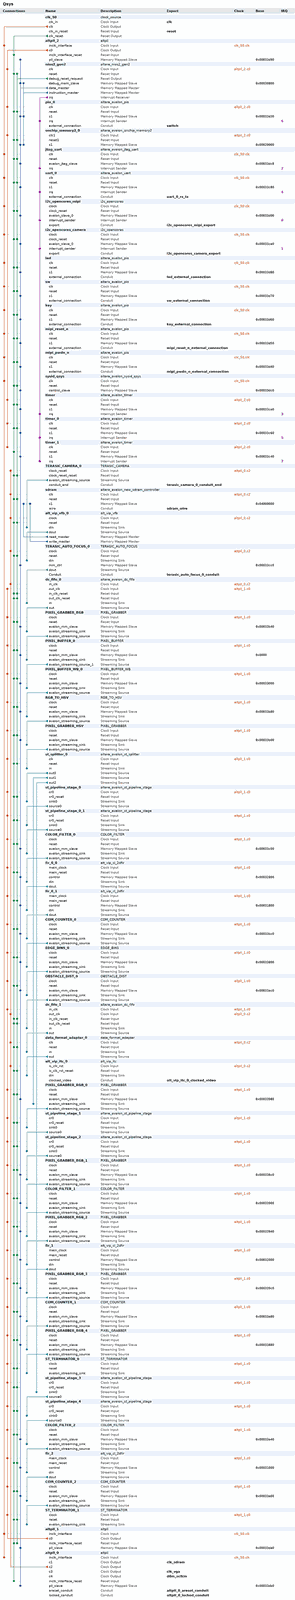
[diagram p0: system contents, whole]
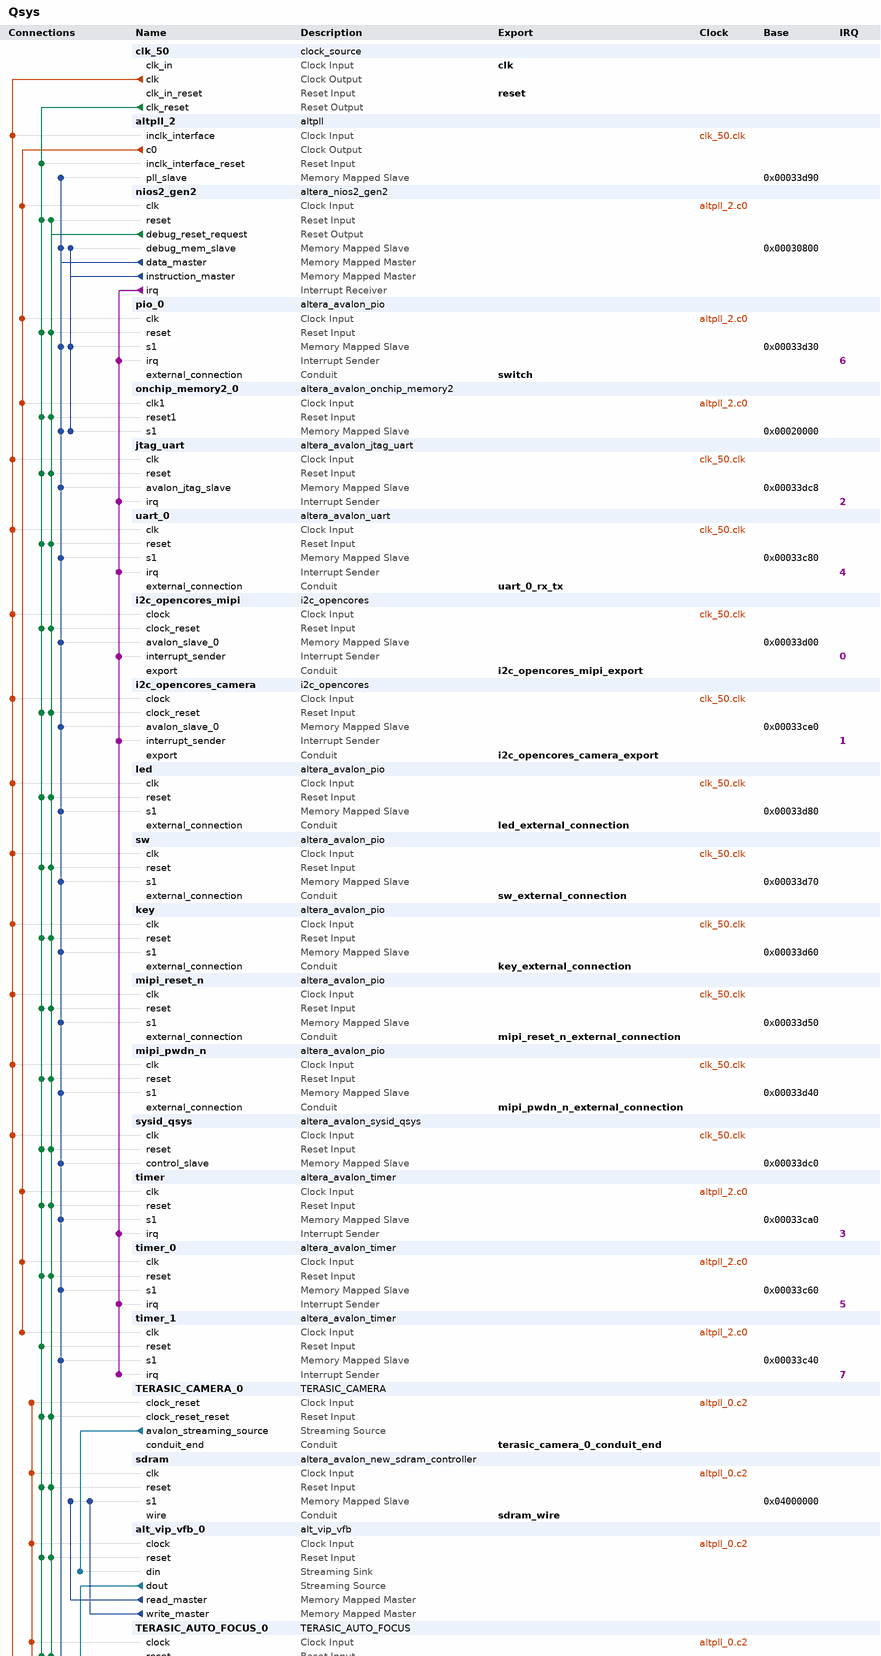
[diagram p1: system contents, upper part]
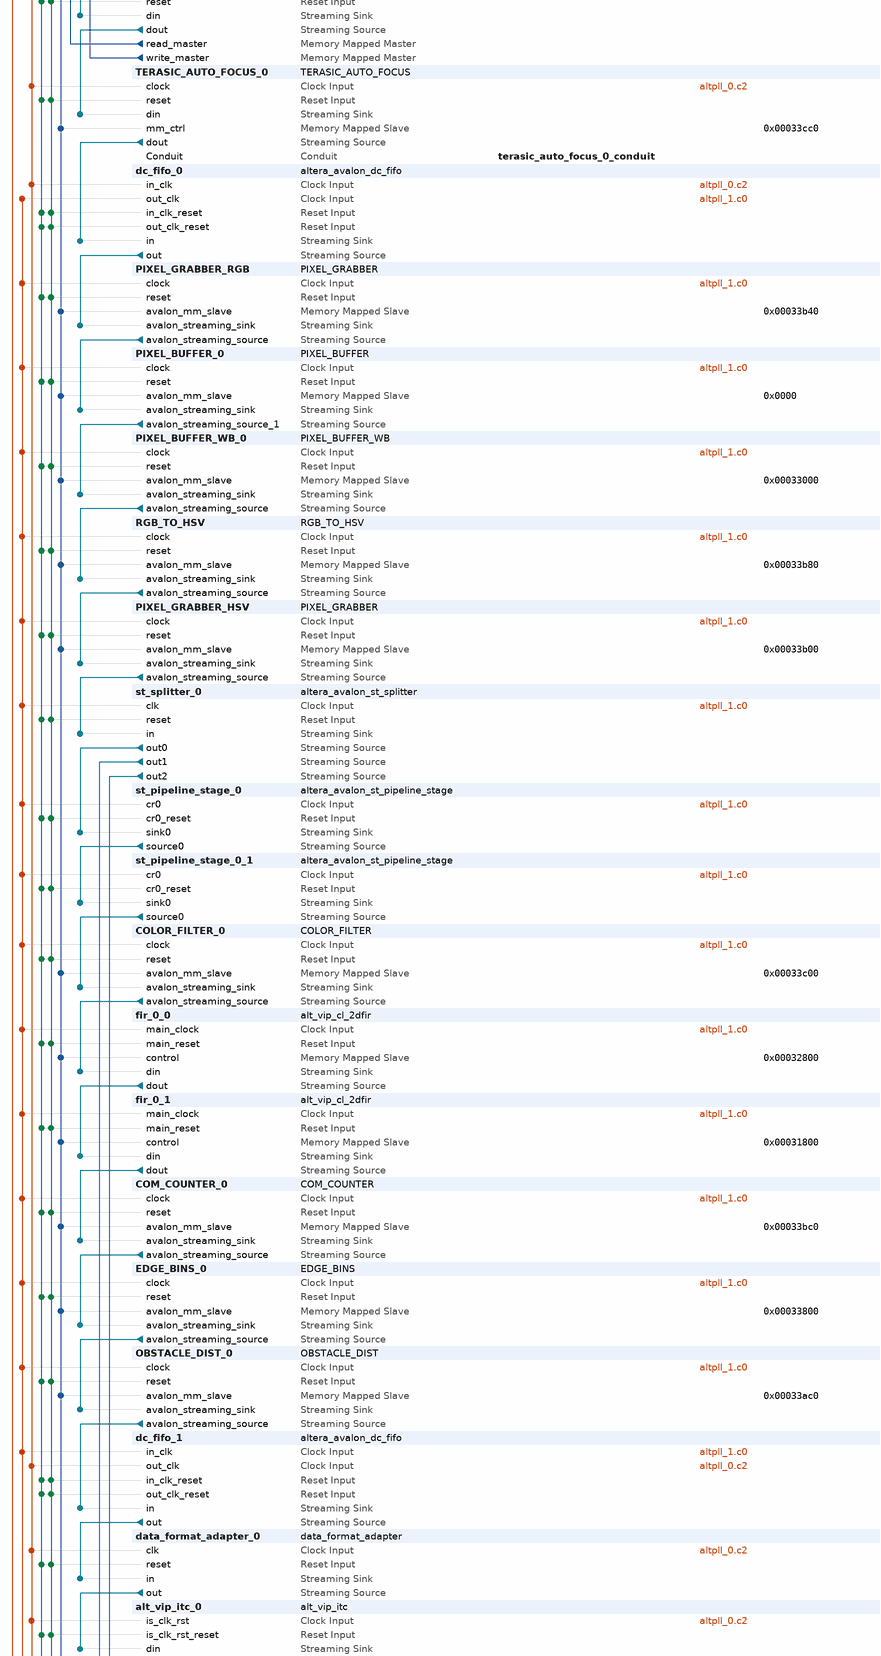
[diagram p2: system contents, middle part]
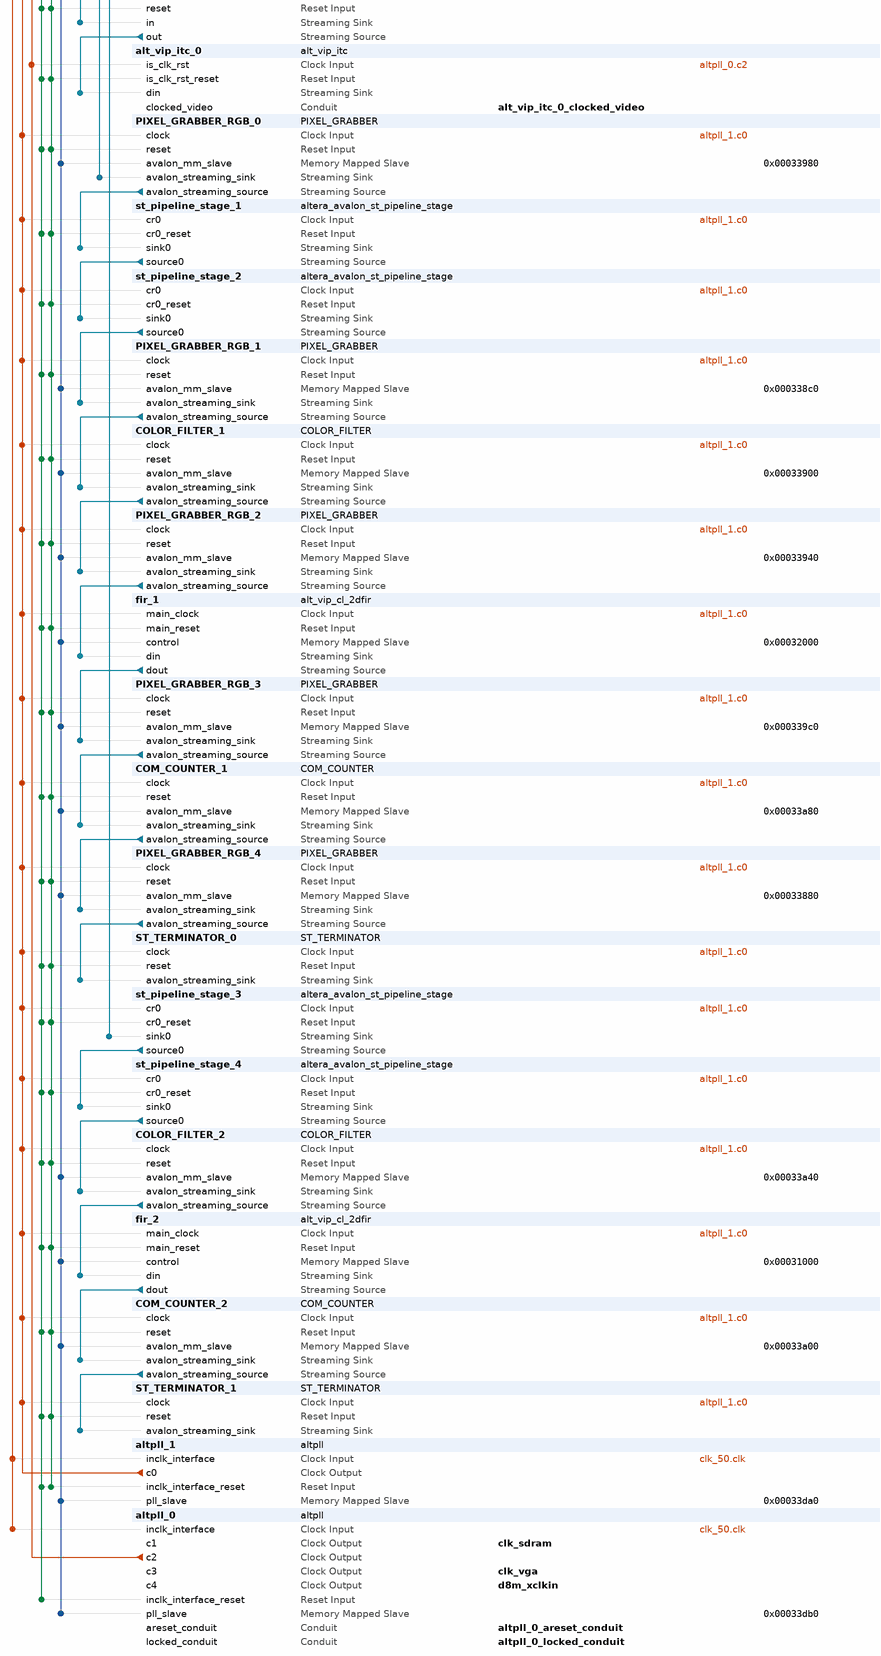
[diagram p3: system contents, lower part]
# Platform Designer (Qsys) system Qsys, MAX 10 10M50DAF484C7G
# Parameters at their usual value, and those the tool derives, are not listed.
package require -exact qsys 18.1
create_system Qsys
set_project_property DEVICE_FAMILY {MAX 10}
set_project_property DEVICE 10M50DAF484C7G

add_instance clk_50 clock_source 18.1
set_instance_parameter_value clk_50 clockFrequency 50000000

add_instance altpll_2 altpll 18.1
set_instance_parameter_value altpll_2 CLK0_DIVIDE_BY 5
set_instance_parameter_value altpll_2 CLK0_MULTIPLY_BY 7
set_instance_parameter_value altpll_2 INCLK0_INPUT_FREQUENCY 20000
set_instance_parameter_value altpll_2 PORT_ARESET PORT_UNUSED
set_instance_parameter_value altpll_2 PORT_LOCKED PORT_UNUSED
set_instance_parameter_value altpll_2 PORT_clk1 PORT_UNUSED
set_instance_parameter_value altpll_2 PORT_clk2 PORT_UNUSED
set_instance_parameter_value altpll_2 PORT_clk3 PORT_UNUSED

add_instance nios2_gen2 altera_nios2_gen2 18.1
set_instance_parameter_value nios2_gen2 dcache_size 4096
set_instance_parameter_value nios2_gen2 exceptionSlave onchip_memory2_0.s1
set_instance_parameter_value nios2_gen2 icache_size 4096
set_instance_parameter_value nios2_gen2 impl Fast
set_instance_parameter_value nios2_gen2 resetSlave onchip_memory2_0.s1

add_instance pio_0 altera_avalon_pio 18.1
set_instance_parameter_value pio_0 captureEdge true
set_instance_parameter_value pio_0 direction Input
set_instance_parameter_value pio_0 generateIRQ true
set_instance_parameter_value pio_0 irqType EDGE
set_instance_parameter_value pio_0 width 1

add_instance onchip_memory2_0 altera_avalon_onchip_memory2 18.1
set_instance_parameter_value onchip_memory2_0 dataWidth 32
set_instance_parameter_value onchip_memory2_0 dualPort false
set_instance_parameter_value onchip_memory2_0 initMemContent true
set_instance_parameter_value onchip_memory2_0 initializationFileName /home/mp3120/nfshome/DE10_CAM_VISION/software/cam_vision2/mem_init/Qsys_onchip_memory2_0.hex
set_instance_parameter_value onchip_memory2_0 memorySize 60000
set_instance_parameter_value onchip_memory2_0 useNonDefaultInitFile true

add_instance jtag_uart altera_avalon_jtag_uart 18.1
set_instance_parameter_value jtag_uart simInteractiveOptions NO_INTERACTIVE_WINDOWS

add_instance uart_0 altera_avalon_uart 18.1
set_instance_parameter_value uart_0 baud 115200
set_instance_parameter_value uart_0 dataBits 8
set_instance_parameter_value uart_0 fixedBaud true
set_instance_parameter_value uart_0 parity NONE
set_instance_parameter_value uart_0 stopBits 1

add_instance i2c_opencores_mipi i2c_opencores 12.0

add_instance i2c_opencores_camera i2c_opencores 12.0

add_instance led altera_avalon_pio 18.1
set_instance_parameter_value led direction Output
set_instance_parameter_value led width 10

add_instance sw altera_avalon_pio 18.1
set_instance_parameter_value sw direction Input
set_instance_parameter_value sw width 10

add_instance key altera_avalon_pio 18.1
set_instance_parameter_value key direction Input
set_instance_parameter_value key width 2

add_instance mipi_reset_n altera_avalon_pio 18.1
set_instance_parameter_value mipi_reset_n direction Output
set_instance_parameter_value mipi_reset_n width 1

add_instance mipi_pwdn_n altera_avalon_pio 18.1
set_instance_parameter_value mipi_pwdn_n direction Output
set_instance_parameter_value mipi_pwdn_n width 1

add_instance sysid_qsys altera_avalon_sysid_qsys 18.1
set_instance_parameter_value sysid_qsys id 0

add_instance timer altera_avalon_timer 18.1
set_instance_parameter_value timer period 1
set_instance_parameter_value timer periodUnits MSEC

add_instance timer_0 altera_avalon_timer 18.1
set_instance_parameter_value timer_0 alwaysRun true
set_instance_parameter_value timer_0 fixedPeriod true
set_instance_parameter_value timer_0 period 1
set_instance_parameter_value timer_0 periodUnits SEC
set_instance_parameter_value timer_0 snapshot false

add_instance timer_1 altera_avalon_timer 18.1
set_instance_parameter_value timer_1 alwaysRun true
set_instance_parameter_value timer_1 fixedPeriod true
set_instance_parameter_value timer_1 period 1
set_instance_parameter_value timer_1 periodUnits SEC
set_instance_parameter_value timer_1 snapshot false

add_instance TERASIC_CAMERA_0 TERASIC_CAMERA 1.0

add_instance sdram altera_avalon_new_sdram_controller 18.1
set_instance_parameter_value sdram TAC 5.5
set_instance_parameter_value sdram TRCD 20.0
set_instance_parameter_value sdram TRP 20.0
set_instance_parameter_value sdram casLatency 3
set_instance_parameter_value sdram columnWidth 10
set_instance_parameter_value sdram dataWidth 16
set_instance_parameter_value sdram generateSimulationModel true
set_instance_parameter_value sdram model single_Micron_MT48LC4M32B2_7_chip
set_instance_parameter_value sdram numberOfBanks 4
set_instance_parameter_value sdram numberOfChipSelects 1
set_instance_parameter_value sdram powerUpDelay 100.0
set_instance_parameter_value sdram refreshPeriod 15.625
set_instance_parameter_value sdram rowWidth 13

add_instance alt_vip_vfb_0 alt_vip_vfb 13.1

add_instance TERASIC_AUTO_FOCUS_0 TERASIC_AUTO_FOCUS 1.0

add_instance dc_fifo_0 altera_avalon_dc_fifo 18.1
set_instance_parameter_value dc_fifo_0 BITS_PER_SYMBOL 8
set_instance_parameter_value dc_fifo_0 FIFO_DEPTH 128
set_instance_parameter_value dc_fifo_0 SYMBOLS_PER_BEAT 3
set_instance_parameter_value dc_fifo_0 USE_PACKETS 1

add_instance PIXEL_GRABBER_RGB PIXEL_GRABBER 1.1
set_instance_parameter_value PIXEL_GRABBER_RGB height 480
set_instance_parameter_value PIXEL_GRABBER_RGB width 640

add_instance PIXEL_BUFFER_0 PIXEL_BUFFER 2.1
set_instance_parameter_value PIXEL_BUFFER_0 clog_sub_factor 3
set_instance_parameter_value PIXEL_BUFFER_0 height 480
set_instance_parameter_value PIXEL_BUFFER_0 sub_factor 8
set_instance_parameter_value PIXEL_BUFFER_0 width 640

add_instance PIXEL_BUFFER_WB_0 PIXEL_BUFFER_WB 1.0
set_instance_parameter_value PIXEL_BUFFER_WB_0 clog_sub_factor 5
set_instance_parameter_value PIXEL_BUFFER_WB_0 height 480
set_instance_parameter_value PIXEL_BUFFER_WB_0 sub_factor 32
set_instance_parameter_value PIXEL_BUFFER_WB_0 width 640

add_instance RGB_TO_HSV RGB_TO_HSV 4.0

add_instance PIXEL_GRABBER_HSV PIXEL_GRABBER 1.1
set_instance_parameter_value PIXEL_GRABBER_HSV height 480
set_instance_parameter_value PIXEL_GRABBER_HSV width 640

add_instance st_splitter_0 altera_avalon_st_splitter 18.1
set_instance_parameter_value st_splitter_0 BITS_PER_SYMBOL 8
set_instance_parameter_value st_splitter_0 CHANNEL_WIDTH 1
set_instance_parameter_value st_splitter_0 DATA_WIDTH 24
set_instance_parameter_value st_splitter_0 ERROR_WIDTH 1
set_instance_parameter_value st_splitter_0 MAX_CHANNELS 1
set_instance_parameter_value st_splitter_0 NUMBER_OF_OUTPUTS 3
set_instance_parameter_value st_splitter_0 QUALIFY_VALID_OUT 1
set_instance_parameter_value st_splitter_0 READY_LATENCY 1
set_instance_parameter_value st_splitter_0 USE_CHANNEL 0
set_instance_parameter_value st_splitter_0 USE_DATA 1
set_instance_parameter_value st_splitter_0 USE_ERROR 0
set_instance_parameter_value st_splitter_0 USE_PACKETS 1
set_instance_parameter_value st_splitter_0 USE_READY 1
set_instance_parameter_value st_splitter_0 USE_VALID 1

add_instance st_pipeline_stage_0 altera_avalon_st_pipeline_stage 18.1
set_instance_parameter_value st_pipeline_stage_0 BITS_PER_SYMBOL 8
set_instance_parameter_value st_pipeline_stage_0 CHANNEL_WIDTH 0
set_instance_parameter_value st_pipeline_stage_0 ERROR_WIDTH 0
set_instance_parameter_value st_pipeline_stage_0 MAX_CHANNEL 0
set_instance_parameter_value st_pipeline_stage_0 PIPELINE_READY 1
set_instance_parameter_value st_pipeline_stage_0 SYMBOLS_PER_BEAT 3
set_instance_parameter_value st_pipeline_stage_0 USE_EMPTY 0
set_instance_parameter_value st_pipeline_stage_0 USE_PACKETS 1

add_instance st_pipeline_stage_0_1 altera_avalon_st_pipeline_stage 18.1
set_instance_parameter_value st_pipeline_stage_0_1 BITS_PER_SYMBOL 8
set_instance_parameter_value st_pipeline_stage_0_1 CHANNEL_WIDTH 0
set_instance_parameter_value st_pipeline_stage_0_1 ERROR_WIDTH 0
set_instance_parameter_value st_pipeline_stage_0_1 MAX_CHANNEL 0
set_instance_parameter_value st_pipeline_stage_0_1 PIPELINE_READY 1
set_instance_parameter_value st_pipeline_stage_0_1 SYMBOLS_PER_BEAT 3
set_instance_parameter_value st_pipeline_stage_0_1 USE_EMPTY 0
set_instance_parameter_value st_pipeline_stage_0_1 USE_PACKETS 1

add_instance COLOR_FILTER_0 COLOR_FILTER 1.0

add_instance fir_0_0 alt_vip_cl_2dfir 18.1
set_instance_parameter_value fir_0_0 ALGORITHM_NAME STANDARD_FIR
set_instance_parameter_value fir_0_0 BITS_PER_SYMBOL_IN 8
set_instance_parameter_value fir_0_0 BITS_PER_SYMBOL_OUT 8
set_instance_parameter_value fir_0_0 COEFF_FRACTION_BITS 7
set_instance_parameter_value fir_0_0 COEFF_INTEGER_BITS 2
set_instance_parameter_value fir_0_0 COEFF_SIGNED 1
set_instance_parameter_value fir_0_0 COLOR_PLANES_ARE_IN_PARALLEL 1
set_instance_parameter_value fir_0_0 DEFAULT_LOWER_BLUR 0
set_instance_parameter_value fir_0_0 DEFAULT_UPPER_BLUR 15
set_instance_parameter_value fir_0_0 DIAG_SYMMETRIC 0
set_instance_parameter_value fir_0_0 DO_MIRRORING 1
set_instance_parameter_value fir_0_0 ENABLE_WIDE_BLUR_SHARPEN 1
set_instance_parameter_value fir_0_0 EXTRA_PIPELINING 1
set_instance_parameter_value fir_0_0 FAMILY {MAX 10}
set_instance_parameter_value fir_0_0 FIXED_COEFF_FILE "C:\\Users\\micha\\Desktop\\Vision\\DE10_CAM_VISION\\ip\\coefficients.csv"
set_instance_parameter_value fir_0_0 H_SYMMETRIC 0
set_instance_parameter_value fir_0_0 H_TAPS 3
set_instance_parameter_value fir_0_0 INPUT_GUARD_BANDS_ENABLE 0
set_instance_parameter_value fir_0_0 INPUT_GUARD_BAND_LOWER 0
set_instance_parameter_value fir_0_0 INPUT_GUARD_BAND_UPPER 255
set_instance_parameter_value fir_0_0 IS_422 0
set_instance_parameter_value fir_0_0 LIMITED_READBACK 0
set_instance_parameter_value fir_0_0 MAX_HEIGHT 480
set_instance_parameter_value fir_0_0 MAX_WIDTH 640
set_instance_parameter_value fir_0_0 MOVE_BINARY_POINT_RIGHT 0
set_instance_parameter_value fir_0_0 NO_BLANKING 0
set_instance_parameter_value fir_0_0 NUMBER_OF_COLOR_PLANES 3
set_instance_parameter_value fir_0_0 OUTPUT_GUARD_BANDS_ENABLE 0
set_instance_parameter_value fir_0_0 OUTPUT_GUARD_BAND_LOWER 0
set_instance_parameter_value fir_0_0 OUTPUT_GUARD_BAND_UPPER 255
set_instance_parameter_value fir_0_0 PIXELS_IN_PARALLEL 1
set_instance_parameter_value fir_0_0 ROUNDING_METHOD ROUND_HALF_UP
set_instance_parameter_value fir_0_0 RUNTIME_CONTROL 1
set_instance_parameter_value fir_0_0 USER_PACKET_SUPPORT PASSTHROUGH
set_instance_parameter_value fir_0_0 V_SYMMETRIC 0
set_instance_parameter_value fir_0_0 V_TAPS 3

add_instance fir_0_1 alt_vip_cl_2dfir 18.1
set_instance_parameter_value fir_0_1 ALGORITHM_NAME STANDARD_FIR
set_instance_parameter_value fir_0_1 BITS_PER_SYMBOL_IN 8
set_instance_parameter_value fir_0_1 BITS_PER_SYMBOL_OUT 8
set_instance_parameter_value fir_0_1 COEFF_FRACTION_BITS 7
set_instance_parameter_value fir_0_1 COEFF_INTEGER_BITS 2
set_instance_parameter_value fir_0_1 COEFF_SIGNED 1
set_instance_parameter_value fir_0_1 COLOR_PLANES_ARE_IN_PARALLEL 1
set_instance_parameter_value fir_0_1 DEFAULT_LOWER_BLUR 0
set_instance_parameter_value fir_0_1 DEFAULT_UPPER_BLUR 15
set_instance_parameter_value fir_0_1 DIAG_SYMMETRIC 0
set_instance_parameter_value fir_0_1 DO_MIRRORING 1
set_instance_parameter_value fir_0_1 ENABLE_WIDE_BLUR_SHARPEN 1
set_instance_parameter_value fir_0_1 EXTRA_PIPELINING 1
set_instance_parameter_value fir_0_1 FAMILY {MAX 10}
set_instance_parameter_value fir_0_1 FIXED_COEFF_FILE "C:\\Users\\micha\\Desktop\\Vision\\DE10_CAM_VISION\\ip\\coefficients.csv"
set_instance_parameter_value fir_0_1 H_SYMMETRIC 0
set_instance_parameter_value fir_0_1 H_TAPS 3
set_instance_parameter_value fir_0_1 INPUT_GUARD_BANDS_ENABLE 0
set_instance_parameter_value fir_0_1 INPUT_GUARD_BAND_LOWER 0
set_instance_parameter_value fir_0_1 INPUT_GUARD_BAND_UPPER 255
set_instance_parameter_value fir_0_1 IS_422 0
set_instance_parameter_value fir_0_1 LIMITED_READBACK 0
set_instance_parameter_value fir_0_1 MAX_HEIGHT 480
set_instance_parameter_value fir_0_1 MAX_WIDTH 640
set_instance_parameter_value fir_0_1 MOVE_BINARY_POINT_RIGHT 0
set_instance_parameter_value fir_0_1 NO_BLANKING 0
set_instance_parameter_value fir_0_1 NUMBER_OF_COLOR_PLANES 3
set_instance_parameter_value fir_0_1 OUTPUT_GUARD_BANDS_ENABLE 0
set_instance_parameter_value fir_0_1 OUTPUT_GUARD_BAND_LOWER 0
set_instance_parameter_value fir_0_1 OUTPUT_GUARD_BAND_UPPER 255
set_instance_parameter_value fir_0_1 PIXELS_IN_PARALLEL 1
set_instance_parameter_value fir_0_1 ROUNDING_METHOD ROUND_HALF_UP
set_instance_parameter_value fir_0_1 RUNTIME_CONTROL 1
set_instance_parameter_value fir_0_1 USER_PACKET_SUPPORT PASSTHROUGH
set_instance_parameter_value fir_0_1 V_SYMMETRIC 0
set_instance_parameter_value fir_0_1 V_TAPS 3

add_instance COM_COUNTER_0 COM_COUNTER 1.4
set_instance_parameter_value COM_COUNTER_0 IMAGE_H 480
set_instance_parameter_value COM_COUNTER_0 IMAGE_W 640

add_instance EDGE_BINS_0 EDGE_BINS 1.0
set_instance_parameter_value EDGE_BINS_0 IMAGE_H 480
set_instance_parameter_value EDGE_BINS_0 IMAGE_W 640

add_instance OBSTACLE_DIST_0 OBSTACLE_DIST 1.0
set_instance_parameter_value OBSTACLE_DIST_0 height 480
set_instance_parameter_value OBSTACLE_DIST_0 width 640

add_instance dc_fifo_1 altera_avalon_dc_fifo 18.1
set_instance_parameter_value dc_fifo_1 BITS_PER_SYMBOL 8
set_instance_parameter_value dc_fifo_1 FIFO_DEPTH 128
set_instance_parameter_value dc_fifo_1 SYMBOLS_PER_BEAT 3
set_instance_parameter_value dc_fifo_1 USE_PACKETS 1

add_instance data_format_adapter_0 data_format_adapter 18.1
set_instance_parameter_value data_format_adapter_0 inBitsPerSymbol 8
set_instance_parameter_value data_format_adapter_0 inChannelWidth 0
set_instance_parameter_value data_format_adapter_0 inErrorWidth 0
set_instance_parameter_value data_format_adapter_0 inMaxChannel 0
set_instance_parameter_value data_format_adapter_0 inReadyLatency 1
set_instance_parameter_value data_format_adapter_0 inSymbolsPerBeat 3
set_instance_parameter_value data_format_adapter_0 inUseEmpty false
set_instance_parameter_value data_format_adapter_0 inUseEmptyPort YES
set_instance_parameter_value data_format_adapter_0 inUsePackets true
set_instance_parameter_value data_format_adapter_0 outSymbolsPerBeat 3
set_instance_parameter_value data_format_adapter_0 outUseEmpty false
set_instance_parameter_value data_format_adapter_0 outUseEmptyPort NO

add_instance alt_vip_itc_0 alt_vip_itc 14.0
set_instance_parameter_value alt_vip_itc_0 FIFO_DEPTH 640
set_instance_parameter_value alt_vip_itc_0 H_ACTIVE_PIXELS 640
set_instance_parameter_value alt_vip_itc_0 H_BACK_PORCH 48
set_instance_parameter_value alt_vip_itc_0 H_FRONT_PORCH 16
set_instance_parameter_value alt_vip_itc_0 H_SYNC_LENGTH 96
set_instance_parameter_value alt_vip_itc_0 NUMBER_OF_COLOUR_PLANES 3
set_instance_parameter_value alt_vip_itc_0 THRESHOLD 639
set_instance_parameter_value alt_vip_itc_0 V_ACTIVE_LINES 480
set_instance_parameter_value alt_vip_itc_0 V_BACK_PORCH 33
set_instance_parameter_value alt_vip_itc_0 V_FRONT_PORCH 10
set_instance_parameter_value alt_vip_itc_0 V_SYNC_LENGTH 2

add_instance PIXEL_GRABBER_RGB_0 PIXEL_GRABBER 1.1
set_instance_parameter_value PIXEL_GRABBER_RGB_0 height 480
set_instance_parameter_value PIXEL_GRABBER_RGB_0 width 640

add_instance st_pipeline_stage_1 altera_avalon_st_pipeline_stage 18.1
set_instance_parameter_value st_pipeline_stage_1 BITS_PER_SYMBOL 8
set_instance_parameter_value st_pipeline_stage_1 CHANNEL_WIDTH 0
set_instance_parameter_value st_pipeline_stage_1 ERROR_WIDTH 0
set_instance_parameter_value st_pipeline_stage_1 MAX_CHANNEL 0
set_instance_parameter_value st_pipeline_stage_1 PIPELINE_READY 1
set_instance_parameter_value st_pipeline_stage_1 SYMBOLS_PER_BEAT 3
set_instance_parameter_value st_pipeline_stage_1 USE_EMPTY 0
set_instance_parameter_value st_pipeline_stage_1 USE_PACKETS 1

add_instance st_pipeline_stage_2 altera_avalon_st_pipeline_stage 18.1
set_instance_parameter_value st_pipeline_stage_2 BITS_PER_SYMBOL 8
set_instance_parameter_value st_pipeline_stage_2 CHANNEL_WIDTH 0
set_instance_parameter_value st_pipeline_stage_2 ERROR_WIDTH 0
set_instance_parameter_value st_pipeline_stage_2 MAX_CHANNEL 0
set_instance_parameter_value st_pipeline_stage_2 PIPELINE_READY 1
set_instance_parameter_value st_pipeline_stage_2 SYMBOLS_PER_BEAT 3
set_instance_parameter_value st_pipeline_stage_2 USE_EMPTY 0
set_instance_parameter_value st_pipeline_stage_2 USE_PACKETS 1

add_instance PIXEL_GRABBER_RGB_1 PIXEL_GRABBER 1.1
set_instance_parameter_value PIXEL_GRABBER_RGB_1 height 480
set_instance_parameter_value PIXEL_GRABBER_RGB_1 width 640

add_instance COLOR_FILTER_1 COLOR_FILTER 1.0

add_instance PIXEL_GRABBER_RGB_2 PIXEL_GRABBER 1.1
set_instance_parameter_value PIXEL_GRABBER_RGB_2 height 480
set_instance_parameter_value PIXEL_GRABBER_RGB_2 width 640

add_instance fir_1 alt_vip_cl_2dfir 18.1
set_instance_parameter_value fir_1 ALGORITHM_NAME STANDARD_FIR
set_instance_parameter_value fir_1 BITS_PER_SYMBOL_IN 8
set_instance_parameter_value fir_1 BITS_PER_SYMBOL_OUT 8
set_instance_parameter_value fir_1 COEFF_FRACTION_BITS 7
set_instance_parameter_value fir_1 COEFF_INTEGER_BITS 2
set_instance_parameter_value fir_1 COEFF_SIGNED 1
set_instance_parameter_value fir_1 COLOR_PLANES_ARE_IN_PARALLEL 1
set_instance_parameter_value fir_1 DEFAULT_LOWER_BLUR 0
set_instance_parameter_value fir_1 DEFAULT_UPPER_BLUR 15
set_instance_parameter_value fir_1 DIAG_SYMMETRIC 0
set_instance_parameter_value fir_1 DO_MIRRORING 1
set_instance_parameter_value fir_1 ENABLE_WIDE_BLUR_SHARPEN 1
set_instance_parameter_value fir_1 EXTRA_PIPELINING 1
set_instance_parameter_value fir_1 FAMILY {MAX 10}
set_instance_parameter_value fir_1 FIXED_COEFF_FILE "C:\\Users\\micha\\Desktop\\Vision\\DE10_CAM_VISION\\ip\\coefficients.csv"
set_instance_parameter_value fir_1 H_SYMMETRIC 0
set_instance_parameter_value fir_1 H_TAPS 3
set_instance_parameter_value fir_1 INPUT_GUARD_BANDS_ENABLE 0
set_instance_parameter_value fir_1 INPUT_GUARD_BAND_LOWER 0
set_instance_parameter_value fir_1 INPUT_GUARD_BAND_UPPER 255
set_instance_parameter_value fir_1 IS_422 0
set_instance_parameter_value fir_1 LIMITED_READBACK 0
set_instance_parameter_value fir_1 MAX_HEIGHT 480
set_instance_parameter_value fir_1 MAX_WIDTH 640
set_instance_parameter_value fir_1 MOVE_BINARY_POINT_RIGHT 0
set_instance_parameter_value fir_1 NO_BLANKING 0
set_instance_parameter_value fir_1 NUMBER_OF_COLOR_PLANES 3
set_instance_parameter_value fir_1 OUTPUT_GUARD_BANDS_ENABLE 0
set_instance_parameter_value fir_1 OUTPUT_GUARD_BAND_LOWER 0
set_instance_parameter_value fir_1 OUTPUT_GUARD_BAND_UPPER 255
set_instance_parameter_value fir_1 PIXELS_IN_PARALLEL 1
set_instance_parameter_value fir_1 ROUNDING_METHOD ROUND_HALF_UP
set_instance_parameter_value fir_1 RUNTIME_CONTROL 1
set_instance_parameter_value fir_1 USER_PACKET_SUPPORT PASSTHROUGH
set_instance_parameter_value fir_1 V_SYMMETRIC 0
set_instance_parameter_value fir_1 V_TAPS 3

add_instance PIXEL_GRABBER_RGB_3 PIXEL_GRABBER 1.1
set_instance_parameter_value PIXEL_GRABBER_RGB_3 height 480
set_instance_parameter_value PIXEL_GRABBER_RGB_3 width 640

add_instance COM_COUNTER_1 COM_COUNTER 1.4
set_instance_parameter_value COM_COUNTER_1 IMAGE_H 480
set_instance_parameter_value COM_COUNTER_1 IMAGE_W 640

add_instance PIXEL_GRABBER_RGB_4 PIXEL_GRABBER 1.1
set_instance_parameter_value PIXEL_GRABBER_RGB_4 height 480
set_instance_parameter_value PIXEL_GRABBER_RGB_4 width 640

add_instance ST_TERMINATOR_0 ST_TERMINATOR 1.0

add_instance st_pipeline_stage_3 altera_avalon_st_pipeline_stage 18.1
set_instance_parameter_value st_pipeline_stage_3 BITS_PER_SYMBOL 8
set_instance_parameter_value st_pipeline_stage_3 CHANNEL_WIDTH 0
set_instance_parameter_value st_pipeline_stage_3 ERROR_WIDTH 0
set_instance_parameter_value st_pipeline_stage_3 MAX_CHANNEL 0
set_instance_parameter_value st_pipeline_stage_3 PIPELINE_READY 1
set_instance_parameter_value st_pipeline_stage_3 SYMBOLS_PER_BEAT 3
set_instance_parameter_value st_pipeline_stage_3 USE_EMPTY 0
set_instance_parameter_value st_pipeline_stage_3 USE_PACKETS 1

add_instance st_pipeline_stage_4 altera_avalon_st_pipeline_stage 18.1
set_instance_parameter_value st_pipeline_stage_4 BITS_PER_SYMBOL 8
set_instance_parameter_value st_pipeline_stage_4 CHANNEL_WIDTH 0
set_instance_parameter_value st_pipeline_stage_4 ERROR_WIDTH 0
set_instance_parameter_value st_pipeline_stage_4 MAX_CHANNEL 0
set_instance_parameter_value st_pipeline_stage_4 PIPELINE_READY 1
set_instance_parameter_value st_pipeline_stage_4 SYMBOLS_PER_BEAT 3
set_instance_parameter_value st_pipeline_stage_4 USE_EMPTY 0
set_instance_parameter_value st_pipeline_stage_4 USE_PACKETS 1

add_instance COLOR_FILTER_2 COLOR_FILTER 1.0

add_instance fir_2 alt_vip_cl_2dfir 18.1
set_instance_parameter_value fir_2 ALGORITHM_NAME STANDARD_FIR
set_instance_parameter_value fir_2 BITS_PER_SYMBOL_IN 8
set_instance_parameter_value fir_2 BITS_PER_SYMBOL_OUT 8
set_instance_parameter_value fir_2 COEFF_FRACTION_BITS 7
set_instance_parameter_value fir_2 COEFF_INTEGER_BITS 2
set_instance_parameter_value fir_2 COEFF_SIGNED 1
set_instance_parameter_value fir_2 COLOR_PLANES_ARE_IN_PARALLEL 1
set_instance_parameter_value fir_2 DEFAULT_LOWER_BLUR 0
set_instance_parameter_value fir_2 DEFAULT_UPPER_BLUR 15
set_instance_parameter_value fir_2 DIAG_SYMMETRIC 0
set_instance_parameter_value fir_2 DO_MIRRORING 1
set_instance_parameter_value fir_2 ENABLE_WIDE_BLUR_SHARPEN 1
set_instance_parameter_value fir_2 EXTRA_PIPELINING 1
set_instance_parameter_value fir_2 FAMILY {MAX 10}
set_instance_parameter_value fir_2 FIXED_COEFF_FILE "C:\\Users\\micha\\Desktop\\Vision\\DE10_CAM_VISION\\ip\\coefficients.csv"
set_instance_parameter_value fir_2 H_SYMMETRIC 0
set_instance_parameter_value fir_2 H_TAPS 3
set_instance_parameter_value fir_2 INPUT_GUARD_BANDS_ENABLE 0
set_instance_parameter_value fir_2 INPUT_GUARD_BAND_LOWER 0
set_instance_parameter_value fir_2 INPUT_GUARD_BAND_UPPER 255
set_instance_parameter_value fir_2 IS_422 0
set_instance_parameter_value fir_2 LIMITED_READBACK 0
set_instance_parameter_value fir_2 MAX_HEIGHT 480
set_instance_parameter_value fir_2 MAX_WIDTH 640
set_instance_parameter_value fir_2 MOVE_BINARY_POINT_RIGHT 0
set_instance_parameter_value fir_2 NO_BLANKING 0
set_instance_parameter_value fir_2 NUMBER_OF_COLOR_PLANES 3
set_instance_parameter_value fir_2 OUTPUT_GUARD_BANDS_ENABLE 0
set_instance_parameter_value fir_2 OUTPUT_GUARD_BAND_LOWER 0
set_instance_parameter_value fir_2 OUTPUT_GUARD_BAND_UPPER 255
set_instance_parameter_value fir_2 PIXELS_IN_PARALLEL 1
set_instance_parameter_value fir_2 ROUNDING_METHOD ROUND_HALF_UP
set_instance_parameter_value fir_2 RUNTIME_CONTROL 1
set_instance_parameter_value fir_2 USER_PACKET_SUPPORT PASSTHROUGH
set_instance_parameter_value fir_2 V_SYMMETRIC 0
set_instance_parameter_value fir_2 V_TAPS 3

add_instance COM_COUNTER_2 COM_COUNTER 1.4
set_instance_parameter_value COM_COUNTER_2 IMAGE_H 480
set_instance_parameter_value COM_COUNTER_2 IMAGE_W 640

add_instance ST_TERMINATOR_1 ST_TERMINATOR 1.0

add_instance altpll_1 altpll 18.1
set_instance_parameter_value altpll_1 CLK0_DIVIDE_BY 5
set_instance_parameter_value altpll_1 CLK0_MULTIPLY_BY 9
set_instance_parameter_value altpll_1 INCLK0_INPUT_FREQUENCY 20000
set_instance_parameter_value altpll_1 PORT_ARESET PORT_UNUSED
set_instance_parameter_value altpll_1 PORT_LOCKED PORT_UNUSED
set_instance_parameter_value altpll_1 PORT_clk1 PORT_UNUSED
set_instance_parameter_value altpll_1 PORT_clk2 PORT_UNUSED
set_instance_parameter_value altpll_1 PORT_clk3 PORT_UNUSED

add_instance altpll_0 altpll 18.1
set_instance_parameter_value altpll_0 CLK0_DIVIDE_BY 1
set_instance_parameter_value altpll_0 CLK0_MULTIPLY_BY 2
set_instance_parameter_value altpll_0 CLK1_DIVIDE_BY 1
set_instance_parameter_value altpll_0 CLK1_DUTY_CYCLE 50
set_instance_parameter_value altpll_0 CLK1_MULTIPLY_BY 2
set_instance_parameter_value altpll_0 CLK1_PHASE_SHIFT 7500
set_instance_parameter_value altpll_0 CLK2_DIVIDE_BY 1
set_instance_parameter_value altpll_0 CLK2_DUTY_CYCLE 50
set_instance_parameter_value altpll_0 CLK2_MULTIPLY_BY 2
set_instance_parameter_value altpll_0 CLK2_PHASE_SHIFT 0
set_instance_parameter_value altpll_0 CLK3_DIVIDE_BY 2
set_instance_parameter_value altpll_0 CLK3_DUTY_CYCLE 50
set_instance_parameter_value altpll_0 CLK3_MULTIPLY_BY 1
set_instance_parameter_value altpll_0 CLK3_PHASE_SHIFT 0
set_instance_parameter_value altpll_0 CLK4_DIVIDE_BY 5
set_instance_parameter_value altpll_0 CLK4_DUTY_CYCLE 50
set_instance_parameter_value altpll_0 CLK4_MULTIPLY_BY 2
set_instance_parameter_value altpll_0 CLK4_PHASE_SHIFT 0
set_instance_parameter_value altpll_0 INCLK0_INPUT_FREQUENCY 20000
set_instance_parameter_value altpll_0 PORT_ARESET PORT_USED
set_instance_parameter_value altpll_0 PORT_LOCKED PORT_USED
set_instance_parameter_value altpll_0 PORT_clk1 PORT_USED
set_instance_parameter_value altpll_0 PORT_clk2 PORT_USED
set_instance_parameter_value altpll_0 PORT_clk3 PORT_USED
set_instance_parameter_value altpll_0 PORT_clk4 PORT_USED

# connections
add_connection altpll_0.c2 alt_vip_itc_0.is_clk_rst clock
add_connection altpll_0.c2 alt_vip_vfb_0.clock clock
add_connection altpll_0.c2 data_format_adapter_0.clk clock
add_connection altpll_0.c2 dc_fifo_0.in_clk clock
add_connection altpll_0.c2 dc_fifo_1.out_clk clock
add_connection altpll_0.c2 sdram.clk clock
add_connection altpll_0.c2 TERASIC_AUTO_FOCUS_0.clock clock
add_connection altpll_0.c2 TERASIC_CAMERA_0.clock_reset clock
add_connection altpll_1.c0 COLOR_FILTER_0.clock clock
add_connection altpll_1.c0 COLOR_FILTER_1.clock clock
add_connection altpll_1.c0 COLOR_FILTER_2.clock clock
add_connection altpll_1.c0 COM_COUNTER_0.clock clock
add_connection altpll_1.c0 COM_COUNTER_1.clock clock
add_connection altpll_1.c0 COM_COUNTER_2.clock clock
add_connection altpll_1.c0 dc_fifo_0.out_clk clock
add_connection altpll_1.c0 dc_fifo_1.in_clk clock
add_connection altpll_1.c0 EDGE_BINS_0.clock clock
add_connection altpll_1.c0 fir_0_0.main_clock clock
add_connection altpll_1.c0 fir_0_1.main_clock clock
add_connection altpll_1.c0 fir_1.main_clock clock
add_connection altpll_1.c0 fir_2.main_clock clock
add_connection altpll_1.c0 OBSTACLE_DIST_0.clock clock
add_connection altpll_1.c0 PIXEL_BUFFER_0.clock clock
add_connection altpll_1.c0 PIXEL_BUFFER_WB_0.clock clock
add_connection altpll_1.c0 PIXEL_GRABBER_HSV.clock clock
add_connection altpll_1.c0 PIXEL_GRABBER_RGB.clock clock
add_connection altpll_1.c0 PIXEL_GRABBER_RGB_0.clock clock
add_connection altpll_1.c0 PIXEL_GRABBER_RGB_1.clock clock
add_connection altpll_1.c0 PIXEL_GRABBER_RGB_2.clock clock
add_connection altpll_1.c0 PIXEL_GRABBER_RGB_3.clock clock
add_connection altpll_1.c0 PIXEL_GRABBER_RGB_4.clock clock
add_connection altpll_1.c0 RGB_TO_HSV.clock clock
add_connection altpll_1.c0 st_pipeline_stage_0.cr0 clock
add_connection altpll_1.c0 st_pipeline_stage_0_1.cr0 clock
add_connection altpll_1.c0 st_pipeline_stage_1.cr0 clock
add_connection altpll_1.c0 st_pipeline_stage_2.cr0 clock
add_connection altpll_1.c0 st_pipeline_stage_3.cr0 clock
add_connection altpll_1.c0 st_pipeline_stage_4.cr0 clock
add_connection altpll_1.c0 st_splitter_0.clk clock
add_connection altpll_1.c0 ST_TERMINATOR_0.clock clock
add_connection altpll_1.c0 ST_TERMINATOR_1.clock clock
add_connection altpll_2.c0 nios2_gen2.clk clock
add_connection altpll_2.c0 onchip_memory2_0.clk1 clock
add_connection altpll_2.c0 pio_0.clk clock
add_connection altpll_2.c0 timer.clk clock
add_connection altpll_2.c0 timer_0.clk clock
add_connection altpll_2.c0 timer_1.clk clock
add_connection clk_50.clk altpll_0.inclk_interface clock
add_connection clk_50.clk altpll_1.inclk_interface clock
add_connection clk_50.clk altpll_2.inclk_interface clock
add_connection clk_50.clk i2c_opencores_camera.clock clock
add_connection clk_50.clk i2c_opencores_mipi.clock clock
add_connection clk_50.clk jtag_uart.clk clock
add_connection clk_50.clk key.clk clock
add_connection clk_50.clk led.clk clock
add_connection clk_50.clk mipi_pwdn_n.clk clock
add_connection clk_50.clk mipi_reset_n.clk clock
add_connection clk_50.clk sw.clk clock
add_connection clk_50.clk sysid_qsys.clk clock
add_connection clk_50.clk uart_0.clk clock
add_connection clk_50.clk_reset alt_vip_itc_0.is_clk_rst_reset reset
add_connection clk_50.clk_reset alt_vip_vfb_0.reset reset
add_connection clk_50.clk_reset altpll_0.inclk_interface_reset reset
add_connection clk_50.clk_reset altpll_1.inclk_interface_reset reset
add_connection clk_50.clk_reset altpll_2.inclk_interface_reset reset
add_connection clk_50.clk_reset COLOR_FILTER_0.reset reset
add_connection clk_50.clk_reset COLOR_FILTER_1.reset reset
add_connection clk_50.clk_reset COLOR_FILTER_2.reset reset
add_connection clk_50.clk_reset COM_COUNTER_0.reset reset
add_connection clk_50.clk_reset COM_COUNTER_1.reset reset
add_connection clk_50.clk_reset COM_COUNTER_2.reset reset
add_connection clk_50.clk_reset data_format_adapter_0.reset reset
add_connection clk_50.clk_reset dc_fifo_0.in_clk_reset reset
add_connection clk_50.clk_reset dc_fifo_0.out_clk_reset reset
add_connection clk_50.clk_reset dc_fifo_1.in_clk_reset reset
add_connection clk_50.clk_reset dc_fifo_1.out_clk_reset reset
add_connection clk_50.clk_reset EDGE_BINS_0.reset reset
add_connection clk_50.clk_reset fir_0_0.main_reset reset
add_connection clk_50.clk_reset fir_0_1.main_reset reset
add_connection clk_50.clk_reset fir_1.main_reset reset
add_connection clk_50.clk_reset fir_2.main_reset reset
add_connection clk_50.clk_reset i2c_opencores_camera.clock_reset reset
add_connection clk_50.clk_reset i2c_opencores_mipi.clock_reset reset
add_connection clk_50.clk_reset jtag_uart.reset reset
add_connection clk_50.clk_reset key.reset reset
add_connection clk_50.clk_reset led.reset reset
add_connection clk_50.clk_reset mipi_pwdn_n.reset reset
add_connection clk_50.clk_reset mipi_reset_n.reset reset
add_connection clk_50.clk_reset nios2_gen2.reset reset
add_connection clk_50.clk_reset OBSTACLE_DIST_0.reset reset
add_connection clk_50.clk_reset onchip_memory2_0.reset1 reset
add_connection clk_50.clk_reset pio_0.reset reset
add_connection clk_50.clk_reset PIXEL_BUFFER_0.reset reset
add_connection clk_50.clk_reset PIXEL_BUFFER_WB_0.reset reset
add_connection clk_50.clk_reset PIXEL_GRABBER_HSV.reset reset
add_connection clk_50.clk_reset PIXEL_GRABBER_RGB.reset reset
add_connection clk_50.clk_reset PIXEL_GRABBER_RGB_0.reset reset
add_connection clk_50.clk_reset PIXEL_GRABBER_RGB_1.reset reset
add_connection clk_50.clk_reset PIXEL_GRABBER_RGB_2.reset reset
add_connection clk_50.clk_reset PIXEL_GRABBER_RGB_3.reset reset
add_connection clk_50.clk_reset PIXEL_GRABBER_RGB_4.reset reset
add_connection clk_50.clk_reset RGB_TO_HSV.reset reset
add_connection clk_50.clk_reset sdram.reset reset
add_connection clk_50.clk_reset st_pipeline_stage_0.cr0_reset reset
add_connection clk_50.clk_reset st_pipeline_stage_0_1.cr0_reset reset
add_connection clk_50.clk_reset st_pipeline_stage_1.cr0_reset reset
add_connection clk_50.clk_reset st_pipeline_stage_2.cr0_reset reset
add_connection clk_50.clk_reset st_pipeline_stage_3.cr0_reset reset
add_connection clk_50.clk_reset st_pipeline_stage_4.cr0_reset reset
add_connection clk_50.clk_reset st_splitter_0.reset reset
add_connection clk_50.clk_reset ST_TERMINATOR_0.reset reset
add_connection clk_50.clk_reset ST_TERMINATOR_1.reset reset
add_connection clk_50.clk_reset sw.reset reset
add_connection clk_50.clk_reset sysid_qsys.reset reset
add_connection clk_50.clk_reset TERASIC_AUTO_FOCUS_0.reset reset
add_connection clk_50.clk_reset TERASIC_CAMERA_0.clock_reset_reset reset
add_connection clk_50.clk_reset timer.reset reset
add_connection clk_50.clk_reset timer_0.reset reset
add_connection clk_50.clk_reset timer_1.reset reset
add_connection clk_50.clk_reset uart_0.reset reset
add_connection nios2_gen2.debug_reset_request alt_vip_itc_0.is_clk_rst_reset reset
add_connection nios2_gen2.debug_reset_request alt_vip_vfb_0.reset reset
add_connection nios2_gen2.debug_reset_request altpll_1.inclk_interface_reset reset
add_connection nios2_gen2.debug_reset_request COLOR_FILTER_0.reset reset
add_connection nios2_gen2.debug_reset_request COLOR_FILTER_1.reset reset
add_connection nios2_gen2.debug_reset_request COLOR_FILTER_2.reset reset
add_connection nios2_gen2.debug_reset_request COM_COUNTER_0.reset reset
add_connection nios2_gen2.debug_reset_request COM_COUNTER_1.reset reset
add_connection nios2_gen2.debug_reset_request COM_COUNTER_2.reset reset
add_connection nios2_gen2.debug_reset_request data_format_adapter_0.reset reset
add_connection nios2_gen2.debug_reset_request dc_fifo_0.in_clk_reset reset
add_connection nios2_gen2.debug_reset_request dc_fifo_0.out_clk_reset reset
add_connection nios2_gen2.debug_reset_request dc_fifo_1.in_clk_reset reset
add_connection nios2_gen2.debug_reset_request dc_fifo_1.out_clk_reset reset
add_connection nios2_gen2.debug_reset_request EDGE_BINS_0.reset reset
add_connection nios2_gen2.debug_reset_request fir_0_0.main_reset reset
add_connection nios2_gen2.debug_reset_request fir_0_1.main_reset reset
add_connection nios2_gen2.debug_reset_request fir_1.main_reset reset
add_connection nios2_gen2.debug_reset_request fir_2.main_reset reset
add_connection nios2_gen2.debug_reset_request i2c_opencores_camera.clock_reset reset
add_connection nios2_gen2.debug_reset_request i2c_opencores_mipi.clock_reset reset
add_connection nios2_gen2.debug_reset_request jtag_uart.reset reset
add_connection nios2_gen2.debug_reset_request key.reset reset
add_connection nios2_gen2.debug_reset_request led.reset reset
add_connection nios2_gen2.debug_reset_request mipi_pwdn_n.reset reset
add_connection nios2_gen2.debug_reset_request mipi_reset_n.reset reset
add_connection nios2_gen2.debug_reset_request nios2_gen2.reset reset
add_connection nios2_gen2.debug_reset_request OBSTACLE_DIST_0.reset reset
add_connection nios2_gen2.debug_reset_request onchip_memory2_0.reset1 reset
add_connection nios2_gen2.debug_reset_request pio_0.reset reset
add_connection nios2_gen2.debug_reset_request PIXEL_BUFFER_0.reset reset
add_connection nios2_gen2.debug_reset_request PIXEL_BUFFER_WB_0.reset reset
add_connection nios2_gen2.debug_reset_request PIXEL_GRABBER_HSV.reset reset
add_connection nios2_gen2.debug_reset_request PIXEL_GRABBER_RGB.reset reset
add_connection nios2_gen2.debug_reset_request PIXEL_GRABBER_RGB_0.reset reset
add_connection nios2_gen2.debug_reset_request PIXEL_GRABBER_RGB_1.reset reset
add_connection nios2_gen2.debug_reset_request PIXEL_GRABBER_RGB_2.reset reset
add_connection nios2_gen2.debug_reset_request PIXEL_GRABBER_RGB_3.reset reset
add_connection nios2_gen2.debug_reset_request PIXEL_GRABBER_RGB_4.reset reset
add_connection nios2_gen2.debug_reset_request RGB_TO_HSV.reset reset
add_connection nios2_gen2.debug_reset_request sdram.reset reset
add_connection nios2_gen2.debug_reset_request st_pipeline_stage_0.cr0_reset reset
add_connection nios2_gen2.debug_reset_request st_pipeline_stage_0_1.cr0_reset reset
add_connection nios2_gen2.debug_reset_request st_pipeline_stage_1.cr0_reset reset
add_connection nios2_gen2.debug_reset_request st_pipeline_stage_2.cr0_reset reset
add_connection nios2_gen2.debug_reset_request st_pipeline_stage_3.cr0_reset reset
add_connection nios2_gen2.debug_reset_request st_pipeline_stage_4.cr0_reset reset
add_connection nios2_gen2.debug_reset_request st_splitter_0.reset reset
add_connection nios2_gen2.debug_reset_request ST_TERMINATOR_0.reset reset
add_connection nios2_gen2.debug_reset_request ST_TERMINATOR_1.reset reset
add_connection nios2_gen2.debug_reset_request sw.reset reset
add_connection nios2_gen2.debug_reset_request sysid_qsys.reset reset
add_connection nios2_gen2.debug_reset_request TERASIC_AUTO_FOCUS_0.reset reset
add_connection nios2_gen2.debug_reset_request TERASIC_CAMERA_0.clock_reset_reset reset
add_connection nios2_gen2.debug_reset_request timer.reset reset
add_connection nios2_gen2.debug_reset_request timer_0.reset reset
add_connection nios2_gen2.debug_reset_request uart_0.reset reset
add_connection alt_vip_vfb_0.read_master sdram.s1 avalon
set_connection_parameter_value alt_vip_vfb_0.read_master/sdram.s1 arbitrationPriority 50
set_connection_parameter_value alt_vip_vfb_0.read_master/sdram.s1 baseAddress 0x04000000
add_connection alt_vip_vfb_0.write_master sdram.s1 avalon
set_connection_parameter_value alt_vip_vfb_0.write_master/sdram.s1 arbitrationPriority 30
set_connection_parameter_value alt_vip_vfb_0.write_master/sdram.s1 baseAddress 0x04000000
add_connection nios2_gen2.data_master altpll_0.pll_slave avalon
set_connection_parameter_value nios2_gen2.data_master/altpll_0.pll_slave baseAddress 0x00033db0
add_connection nios2_gen2.data_master altpll_1.pll_slave avalon
set_connection_parameter_value nios2_gen2.data_master/altpll_1.pll_slave baseAddress 0x00033da0
add_connection nios2_gen2.data_master altpll_2.pll_slave avalon
set_connection_parameter_value nios2_gen2.data_master/altpll_2.pll_slave baseAddress 0x00033d90
add_connection nios2_gen2.data_master COLOR_FILTER_0.avalon_mm_slave avalon
set_connection_parameter_value nios2_gen2.data_master/COLOR_FILTER_0.avalon_mm_slave baseAddress 0x00033c00
add_connection nios2_gen2.data_master COLOR_FILTER_1.avalon_mm_slave avalon
set_connection_parameter_value nios2_gen2.data_master/COLOR_FILTER_1.avalon_mm_slave baseAddress 0x00033900
add_connection nios2_gen2.data_master COLOR_FILTER_2.avalon_mm_slave avalon
set_connection_parameter_value nios2_gen2.data_master/COLOR_FILTER_2.avalon_mm_slave baseAddress 0x00033a40
add_connection nios2_gen2.data_master COM_COUNTER_0.avalon_mm_slave avalon
set_connection_parameter_value nios2_gen2.data_master/COM_COUNTER_0.avalon_mm_slave baseAddress 0x00033bc0
add_connection nios2_gen2.data_master COM_COUNTER_1.avalon_mm_slave avalon
set_connection_parameter_value nios2_gen2.data_master/COM_COUNTER_1.avalon_mm_slave baseAddress 0x00033a80
add_connection nios2_gen2.data_master COM_COUNTER_2.avalon_mm_slave avalon
set_connection_parameter_value nios2_gen2.data_master/COM_COUNTER_2.avalon_mm_slave baseAddress 0x00033a00
add_connection nios2_gen2.data_master EDGE_BINS_0.avalon_mm_slave avalon
set_connection_parameter_value nios2_gen2.data_master/EDGE_BINS_0.avalon_mm_slave baseAddress 0x00033800
add_connection nios2_gen2.data_master fir_0_0.control avalon
set_connection_parameter_value nios2_gen2.data_master/fir_0_0.control baseAddress 0x00032800
add_connection nios2_gen2.data_master fir_0_1.control avalon
set_connection_parameter_value nios2_gen2.data_master/fir_0_1.control baseAddress 0x00031800
add_connection nios2_gen2.data_master fir_1.control avalon
set_connection_parameter_value nios2_gen2.data_master/fir_1.control baseAddress 0x00032000
add_connection nios2_gen2.data_master fir_2.control avalon
set_connection_parameter_value nios2_gen2.data_master/fir_2.control baseAddress 0x00031000
add_connection nios2_gen2.data_master i2c_opencores_camera.avalon_slave_0 avalon
set_connection_parameter_value nios2_gen2.data_master/i2c_opencores_camera.avalon_slave_0 baseAddress 0x00033ce0
add_connection nios2_gen2.data_master i2c_opencores_mipi.avalon_slave_0 avalon
set_connection_parameter_value nios2_gen2.data_master/i2c_opencores_mipi.avalon_slave_0 baseAddress 0x00033d00
add_connection nios2_gen2.data_master jtag_uart.avalon_jtag_slave avalon
set_connection_parameter_value nios2_gen2.data_master/jtag_uart.avalon_jtag_slave baseAddress 0x00033dc8
add_connection nios2_gen2.data_master key.s1 avalon
set_connection_parameter_value nios2_gen2.data_master/key.s1 baseAddress 0x00033d60
add_connection nios2_gen2.data_master led.s1 avalon
set_connection_parameter_value nios2_gen2.data_master/led.s1 baseAddress 0x00033d80
add_connection nios2_gen2.data_master mipi_pwdn_n.s1 avalon
set_connection_parameter_value nios2_gen2.data_master/mipi_pwdn_n.s1 baseAddress 0x00033d40
add_connection nios2_gen2.data_master mipi_reset_n.s1 avalon
set_connection_parameter_value nios2_gen2.data_master/mipi_reset_n.s1 baseAddress 0x00033d50
add_connection nios2_gen2.data_master nios2_gen2.debug_mem_slave avalon
set_connection_parameter_value nios2_gen2.data_master/nios2_gen2.debug_mem_slave baseAddress 0x00030800
add_connection nios2_gen2.data_master OBSTACLE_DIST_0.avalon_mm_slave avalon
set_connection_parameter_value nios2_gen2.data_master/OBSTACLE_DIST_0.avalon_mm_slave baseAddress 0x00033ac0
add_connection nios2_gen2.data_master onchip_memory2_0.s1 avalon
set_connection_parameter_value nios2_gen2.data_master/onchip_memory2_0.s1 baseAddress 0x00020000
add_connection nios2_gen2.data_master pio_0.s1 avalon
set_connection_parameter_value nios2_gen2.data_master/pio_0.s1 baseAddress 0x00033d30
add_connection nios2_gen2.data_master PIXEL_BUFFER_0.avalon_mm_slave avalon
set_connection_parameter_value nios2_gen2.data_master/PIXEL_BUFFER_0.avalon_mm_slave baseAddress 0x0000
add_connection nios2_gen2.data_master PIXEL_BUFFER_WB_0.avalon_mm_slave avalon
set_connection_parameter_value nios2_gen2.data_master/PIXEL_BUFFER_WB_0.avalon_mm_slave baseAddress 0x00033000
add_connection nios2_gen2.data_master PIXEL_GRABBER_HSV.avalon_mm_slave avalon
set_connection_parameter_value nios2_gen2.data_master/PIXEL_GRABBER_HSV.avalon_mm_slave baseAddress 0x00033b00
add_connection nios2_gen2.data_master PIXEL_GRABBER_RGB.avalon_mm_slave avalon
set_connection_parameter_value nios2_gen2.data_master/PIXEL_GRABBER_RGB.avalon_mm_slave baseAddress 0x00033b40
add_connection nios2_gen2.data_master PIXEL_GRABBER_RGB_0.avalon_mm_slave avalon
set_connection_parameter_value nios2_gen2.data_master/PIXEL_GRABBER_RGB_0.avalon_mm_slave baseAddress 0x00033980
add_connection nios2_gen2.data_master PIXEL_GRABBER_RGB_1.avalon_mm_slave avalon
set_connection_parameter_value nios2_gen2.data_master/PIXEL_GRABBER_RGB_1.avalon_mm_slave baseAddress 0x000338c0
add_connection nios2_gen2.data_master PIXEL_GRABBER_RGB_2.avalon_mm_slave avalon
set_connection_parameter_value nios2_gen2.data_master/PIXEL_GRABBER_RGB_2.avalon_mm_slave baseAddress 0x00033940
add_connection nios2_gen2.data_master PIXEL_GRABBER_RGB_3.avalon_mm_slave avalon
set_connection_parameter_value nios2_gen2.data_master/PIXEL_GRABBER_RGB_3.avalon_mm_slave baseAddress 0x000339c0
add_connection nios2_gen2.data_master PIXEL_GRABBER_RGB_4.avalon_mm_slave avalon
set_connection_parameter_value nios2_gen2.data_master/PIXEL_GRABBER_RGB_4.avalon_mm_slave baseAddress 0x00033880
add_connection nios2_gen2.data_master RGB_TO_HSV.avalon_mm_slave avalon
set_connection_parameter_value nios2_gen2.data_master/RGB_TO_HSV.avalon_mm_slave baseAddress 0x00033b80
add_connection nios2_gen2.data_master sw.s1 avalon
set_connection_parameter_value nios2_gen2.data_master/sw.s1 baseAddress 0x00033d70
add_connection nios2_gen2.data_master sysid_qsys.control_slave avalon
set_connection_parameter_value nios2_gen2.data_master/sysid_qsys.control_slave baseAddress 0x00033dc0
add_connection nios2_gen2.data_master TERASIC_AUTO_FOCUS_0.mm_ctrl avalon
set_connection_parameter_value nios2_gen2.data_master/TERASIC_AUTO_FOCUS_0.mm_ctrl baseAddress 0x00033cc0
add_connection nios2_gen2.data_master timer.s1 avalon
set_connection_parameter_value nios2_gen2.data_master/timer.s1 baseAddress 0x00033ca0
add_connection nios2_gen2.data_master timer_0.s1 avalon
set_connection_parameter_value nios2_gen2.data_master/timer_0.s1 baseAddress 0x00033c60
add_connection nios2_gen2.data_master timer_1.s1 avalon
set_connection_parameter_value nios2_gen2.data_master/timer_1.s1 baseAddress 0x00033c40
add_connection nios2_gen2.data_master uart_0.s1 avalon
set_connection_parameter_value nios2_gen2.data_master/uart_0.s1 baseAddress 0x00033c80
add_connection nios2_gen2.instruction_master nios2_gen2.debug_mem_slave avalon
set_connection_parameter_value nios2_gen2.instruction_master/nios2_gen2.debug_mem_slave baseAddress 0x00030800
add_connection nios2_gen2.instruction_master onchip_memory2_0.s1 avalon
set_connection_parameter_value nios2_gen2.instruction_master/onchip_memory2_0.s1 baseAddress 0x00020000
add_connection nios2_gen2.instruction_master pio_0.s1 avalon
set_connection_parameter_value nios2_gen2.instruction_master/pio_0.s1 baseAddress 0x00033d30
add_connection alt_vip_vfb_0.dout TERASIC_AUTO_FOCUS_0.din avalon_streaming
add_connection COLOR_FILTER_0.avalon_streaming_source fir_0_0.din avalon_streaming
add_connection COLOR_FILTER_1.avalon_streaming_source PIXEL_GRABBER_RGB_2.avalon_streaming_sink avalon_streaming
add_connection COLOR_FILTER_2.avalon_streaming_source fir_2.din avalon_streaming
add_connection COM_COUNTER_0.avalon_streaming_source EDGE_BINS_0.avalon_streaming_sink avalon_streaming
add_connection COM_COUNTER_1.avalon_streaming_source PIXEL_GRABBER_RGB_4.avalon_streaming_sink avalon_streaming
add_connection COM_COUNTER_2.avalon_streaming_source ST_TERMINATOR_1.avalon_streaming_sink avalon_streaming
add_connection data_format_adapter_0.out alt_vip_itc_0.din avalon_streaming
add_connection dc_fifo_0.out PIXEL_GRABBER_RGB.avalon_streaming_sink avalon_streaming
add_connection dc_fifo_1.out data_format_adapter_0.in avalon_streaming
add_connection EDGE_BINS_0.avalon_streaming_source OBSTACLE_DIST_0.avalon_streaming_sink avalon_streaming
add_connection fir_0_0.dout fir_0_1.din avalon_streaming
add_connection fir_0_1.dout COM_COUNTER_0.avalon_streaming_sink avalon_streaming
add_connection fir_1.dout PIXEL_GRABBER_RGB_3.avalon_streaming_sink avalon_streaming
add_connection fir_2.dout COM_COUNTER_2.avalon_streaming_sink avalon_streaming
add_connection OBSTACLE_DIST_0.avalon_streaming_source dc_fifo_1.in avalon_streaming
add_connection PIXEL_BUFFER_0.avalon_streaming_source_1 PIXEL_BUFFER_WB_0.avalon_streaming_sink avalon_streaming
add_connection PIXEL_BUFFER_WB_0.avalon_streaming_source RGB_TO_HSV.avalon_streaming_sink avalon_streaming
add_connection PIXEL_GRABBER_HSV.avalon_streaming_source st_splitter_0.in avalon_streaming
add_connection PIXEL_GRABBER_RGB.avalon_streaming_source PIXEL_BUFFER_0.avalon_streaming_sink avalon_streaming
add_connection PIXEL_GRABBER_RGB_0.avalon_streaming_source st_pipeline_stage_1.sink0 avalon_streaming
add_connection PIXEL_GRABBER_RGB_1.avalon_streaming_source COLOR_FILTER_1.avalon_streaming_sink avalon_streaming
add_connection PIXEL_GRABBER_RGB_2.avalon_streaming_source fir_1.din avalon_streaming
add_connection PIXEL_GRABBER_RGB_3.avalon_streaming_source COM_COUNTER_1.avalon_streaming_sink avalon_streaming
add_connection PIXEL_GRABBER_RGB_4.avalon_streaming_source ST_TERMINATOR_0.avalon_streaming_sink avalon_streaming
add_connection RGB_TO_HSV.avalon_streaming_source PIXEL_GRABBER_HSV.avalon_streaming_sink avalon_streaming
add_connection st_pipeline_stage_0.source0 st_pipeline_stage_0_1.sink0 avalon_streaming
add_connection st_pipeline_stage_0_1.source0 COLOR_FILTER_0.avalon_streaming_sink avalon_streaming
add_connection st_pipeline_stage_1.source0 st_pipeline_stage_2.sink0 avalon_streaming
add_connection st_pipeline_stage_2.source0 PIXEL_GRABBER_RGB_1.avalon_streaming_sink avalon_streaming
add_connection st_pipeline_stage_3.source0 st_pipeline_stage_4.sink0 avalon_streaming
add_connection st_pipeline_stage_4.source0 COLOR_FILTER_2.avalon_streaming_sink avalon_streaming
add_connection st_splitter_0.out0 st_pipeline_stage_0.sink0 avalon_streaming
add_connection st_splitter_0.out1 PIXEL_GRABBER_RGB_0.avalon_streaming_sink avalon_streaming
add_connection st_splitter_0.out2 st_pipeline_stage_3.sink0 avalon_streaming
add_connection TERASIC_AUTO_FOCUS_0.dout dc_fifo_0.in avalon_streaming
add_connection TERASIC_CAMERA_0.avalon_streaming_source alt_vip_vfb_0.din avalon_streaming
add_connection nios2_gen2.irq i2c_opencores_camera.interrupt_sender interrupt
set_connection_parameter_value nios2_gen2.irq/i2c_opencores_camera.interrupt_sender irqNumber 1
add_connection nios2_gen2.irq i2c_opencores_mipi.interrupt_sender interrupt
set_connection_parameter_value nios2_gen2.irq/i2c_opencores_mipi.interrupt_sender irqNumber 0
add_connection nios2_gen2.irq jtag_uart.irq interrupt
set_connection_parameter_value nios2_gen2.irq/jtag_uart.irq irqNumber 2
add_connection nios2_gen2.irq pio_0.irq interrupt
set_connection_parameter_value nios2_gen2.irq/pio_0.irq irqNumber 6
add_connection nios2_gen2.irq timer.irq interrupt
set_connection_parameter_value nios2_gen2.irq/timer.irq irqNumber 3
add_connection nios2_gen2.irq timer_0.irq interrupt
set_connection_parameter_value nios2_gen2.irq/timer_0.irq irqNumber 5
add_connection nios2_gen2.irq timer_1.irq interrupt
set_connection_parameter_value nios2_gen2.irq/timer_1.irq irqNumber 7
add_connection nios2_gen2.irq uart_0.irq interrupt
set_connection_parameter_value nios2_gen2.irq/uart_0.irq irqNumber 4
